# Altium project PCB_Project1.PrjPCB
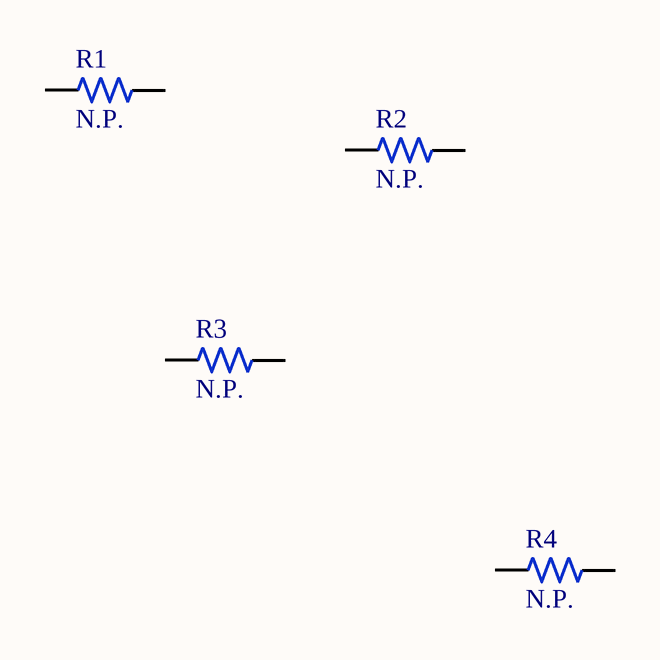
[diagram p0: teste_rep.SchDoc]
1 sheet, 4 parts. Net scope: global (net labels, ports and power ports of the same name join across sheets).

## Sheet teste_rep.SchDoc
size A4

### Parts
R1  N.P.  [0603-3D]
R2  N.P.  [0603-3D]
R3  N.P.  [0603-3D]
R4  N.P.  [0603-3D]

### Nets

Not connected (* = marked no-connect by the designer): R1 1 2; R2 1 2; R3 1 2; R4 1 2

### Library data of the parts
R1-R4 = NP 0603: NO PLACED RESISTOR; User: Jean Pierre; Code: *; Creation Date: 2015/05/29; Version: V01; Size: 0603; Supplier 1: N.A.; Supplier Part Number 1: N.A.; Value: N.P.